# Altium schematic sheet Blackbox_BauhallenUhr_Schematic.SchDoc
size A4; DocumentNumber: 1; SheetNumber: 1; SheetTotal: 5
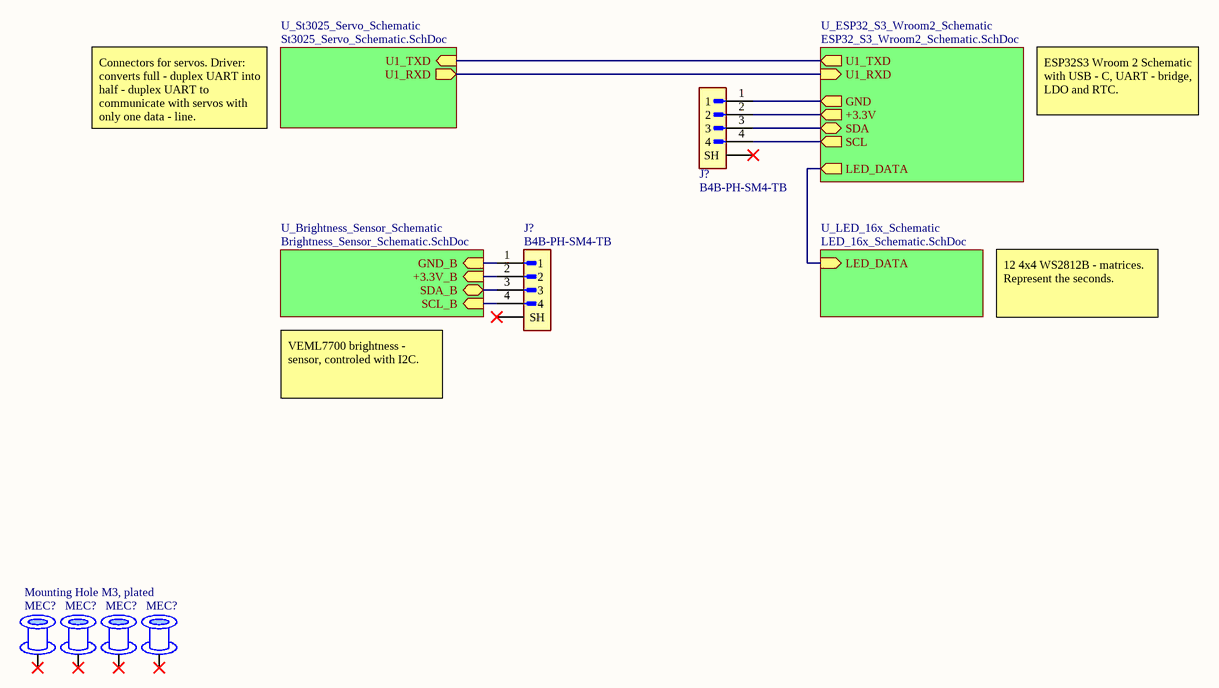
[diagram p0: Blackbox_BauhallenUhr_Schematic.SchDoc]

## Parts
(Parts that share a designator on the sheet are numbered #1, #2 ... from top to bottom, then left to right.)
J?#1  B4B-PH-SM4-TB  [Connector_SMD]
J?#2  B4B-PH-SM4-TB  [Connector_SMD]
MEC?#1  Mounting Hole M3, plated  [Mounting Hole M3, plated]
MEC?#2  Mounting Hole M3, plated  [Mounting Hole M3, plated]  (value not drawn)
MEC?#3  Mounting Hole M3, plated  [Mounting Hole M3, plated]  (value not drawn)
MEC?#4  Mounting Hole M3, plated  [Mounting Hole M3, plated]  (value not drawn)

## Sub-sheets
U_Brightness_Sensor_Schematic = Brightness_Sensor_Schematic.SchDoc: SCL_B (in), SDA_B (bidir), GND_B (in), +3.3V_B (in)
U_ESP32_S3_Wroom2_Schematic = ESP32_S3_Wroom2_Schematic.SchDoc: U1_TXD (out), U1_RXD (in), LED_DATA (out), SCL (out), SDA (bidir), +3.3V (out), GND (out)
U_LED_16x_Schematic = LED_16x_Schematic.SchDoc: LED_DATA (in)
U_St3025_Servo_Schematic = St3025_Servo_Schematic.SchDoc: U1_TXD (in), U1_RXD (out)

## Nets
NetJ?#1_1: J?#1.1 ; sheet U_ESP32_S3_Wroom2_Schematic/GND
NetJ?#1_2: J?#1.2 ; sheet U_ESP32_S3_Wroom2_Schematic/+3.3V
NetJ?#1_3: J?#1.3 ; sheet U_ESP32_S3_Wroom2_Schematic/SDA
NetJ?#1_4: J?#1.4 ; sheet U_ESP32_S3_Wroom2_Schematic/SCL
NetJ?#1_SH1: J?#1.SH1(SH) J?#1.SH2(SHIELD)
NetJ?#2_1: J?#2.1 ; sheet U_Brightness_Sensor_Schematic/GND_B
NetJ?#2_2: J?#2.2 ; sheet U_Brightness_Sensor_Schematic/+3.3V_B
NetJ?#2_3: J?#2.3 ; sheet U_Brightness_Sensor_Schematic/SDA_B
NetJ?#2_4: J?#2.4 ; sheet U_Brightness_Sensor_Schematic/SCL_B
NetJ?#2_SH1: J?#2.SH1(SH) J?#2.SH2(SHIELD)
(unnamed): sheet U_St3025_Servo_Schematic/U1_TXD, sheet U_ESP32_S3_Wroom2_Schematic/U1_TXD
(unnamed): sheet U_St3025_Servo_Schematic/U1_RXD, sheet U_ESP32_S3_Wroom2_Schematic/U1_RXD

Not connected (* = marked no-connect by the designer): MEC?#1 1*; MEC?#2 1*; MEC?#3 1*; MEC?#4 1*

## Buses and harness runs
bus sheet U_ESP32_S3_Wroom2_Schematic/LED_DATA = sheet U_LED_16x_Schematic/LED_DATA

## Notes on the sheet
- Connectors for servos. Driver: converts full - duplex UART into half - duplex UART to communicate with servos with only one data - line.
- ESP32S3 Wroom 2 Schematic with USB - C, UART - bridge, LDO and RTC.
- 12 4x4 WS2812B - matrices. Represent the seconds.
- VEML7700 brightness - sensor, controled with I2C.
- Date:
- Title of drawing:
- Time:
- Drawn by:
- Project:
- Revision:
- Institut:
- Departement:
- Page:
- from:
- File:

## Library data of the parts
J?#1 J?#2 = Connector_SMD_Small_Symbol: CONN HEADER SMD 4POS 2MM.; ComponentLink1Description: Supplier; ComponentLink1URL: https://www.digikey.ch/en/products/detail/jst-sales-america-inc/B4B-PH-SM4-TB/926643
MEC?#1-MEC?#4 = Mounting Hole M3, plated: Mounting Hole for M3 Screw, plated to connect signal